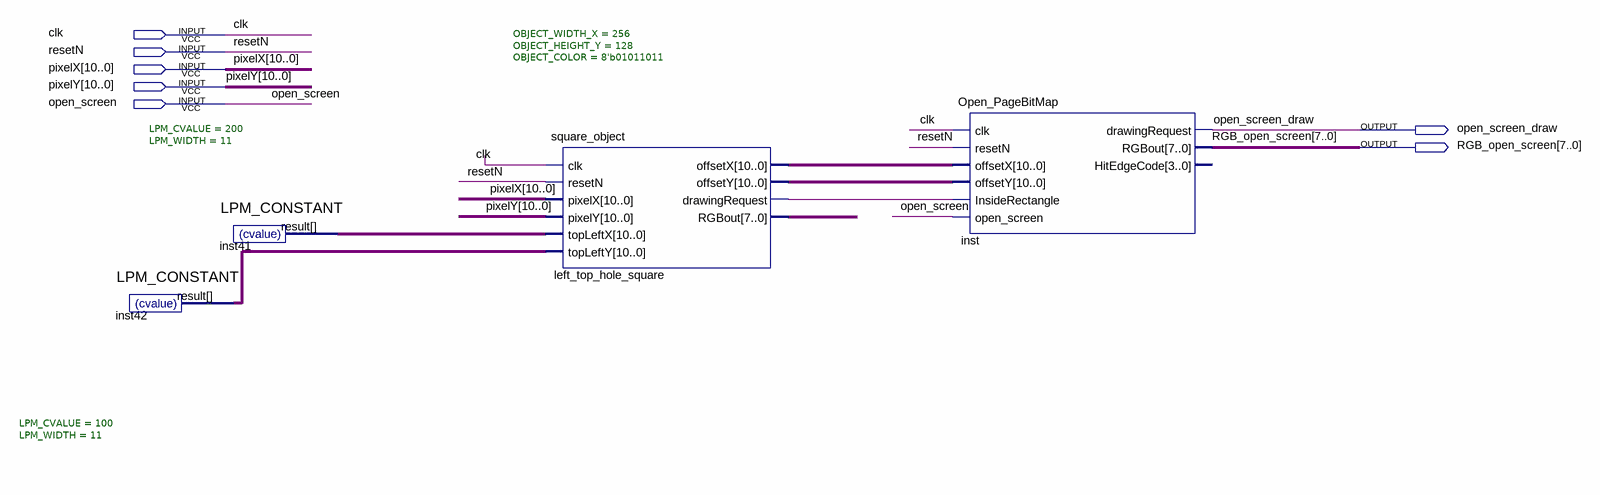
[diagram p0: schematic sheet]
// Quartus schematic Open_Page.bdf as structural Verilog: 4 symbols, 7 pins
module Open_Page (
  input  clk,
  input  resetN,
  input  [10:0] pixelX,
  input  [10:0] pixelY,
  input  open_screen,
  output open_screen_draw,
  output [7:0] RGB_open_screen
);

  wire left_top_hole_square_drawingrequest;
  wire [7:0] left_top_hole_square_rgbout;
  wire [10:0] inst41_result, inst42_result, left_top_hole_square_offsetx, left_top_hole_square_offsety;

  LPM_CONSTANT #(.LPM_CVALUE(100), .LPM_WIDTH(11)) inst42 (.result(inst42_result));
  LPM_CONSTANT #(.LPM_CVALUE(200), .LPM_WIDTH(11)) inst41 (.result(inst41_result));
  square_object #(.OBJECT_WIDTH_X(256), .OBJECT_HEIGHT_Y(128), .OBJECT_COLOR(8'b01011011)) left_top_hole_square (
    .clk(clk), .resetN(resetN), .pixelX(pixelX), .pixelY(pixelY), .topLeftX(inst41_result),
    .topLeftY(inst42_result), .offsetX(left_top_hole_square_offsetx), .offsetY(left_top_hole_square_offsety),
    .drawingRequest(left_top_hole_square_drawingrequest), .RGBout(left_top_hole_square_rgbout));
  Open_PageBitMap inst (
    .clk(clk), .resetN(resetN), .offsetX(left_top_hole_square_offsetx),
    .offsetY(left_top_hole_square_offsety), .InsideRectangle(left_top_hole_square_drawingrequest),
    .open_screen(open_screen), .drawingRequest(open_screen_draw), .RGBout(RGB_open_screen));  // open: HitEdgeCode
endmodule
